# EAGLE design Shield (EAGLE 6.5.0)
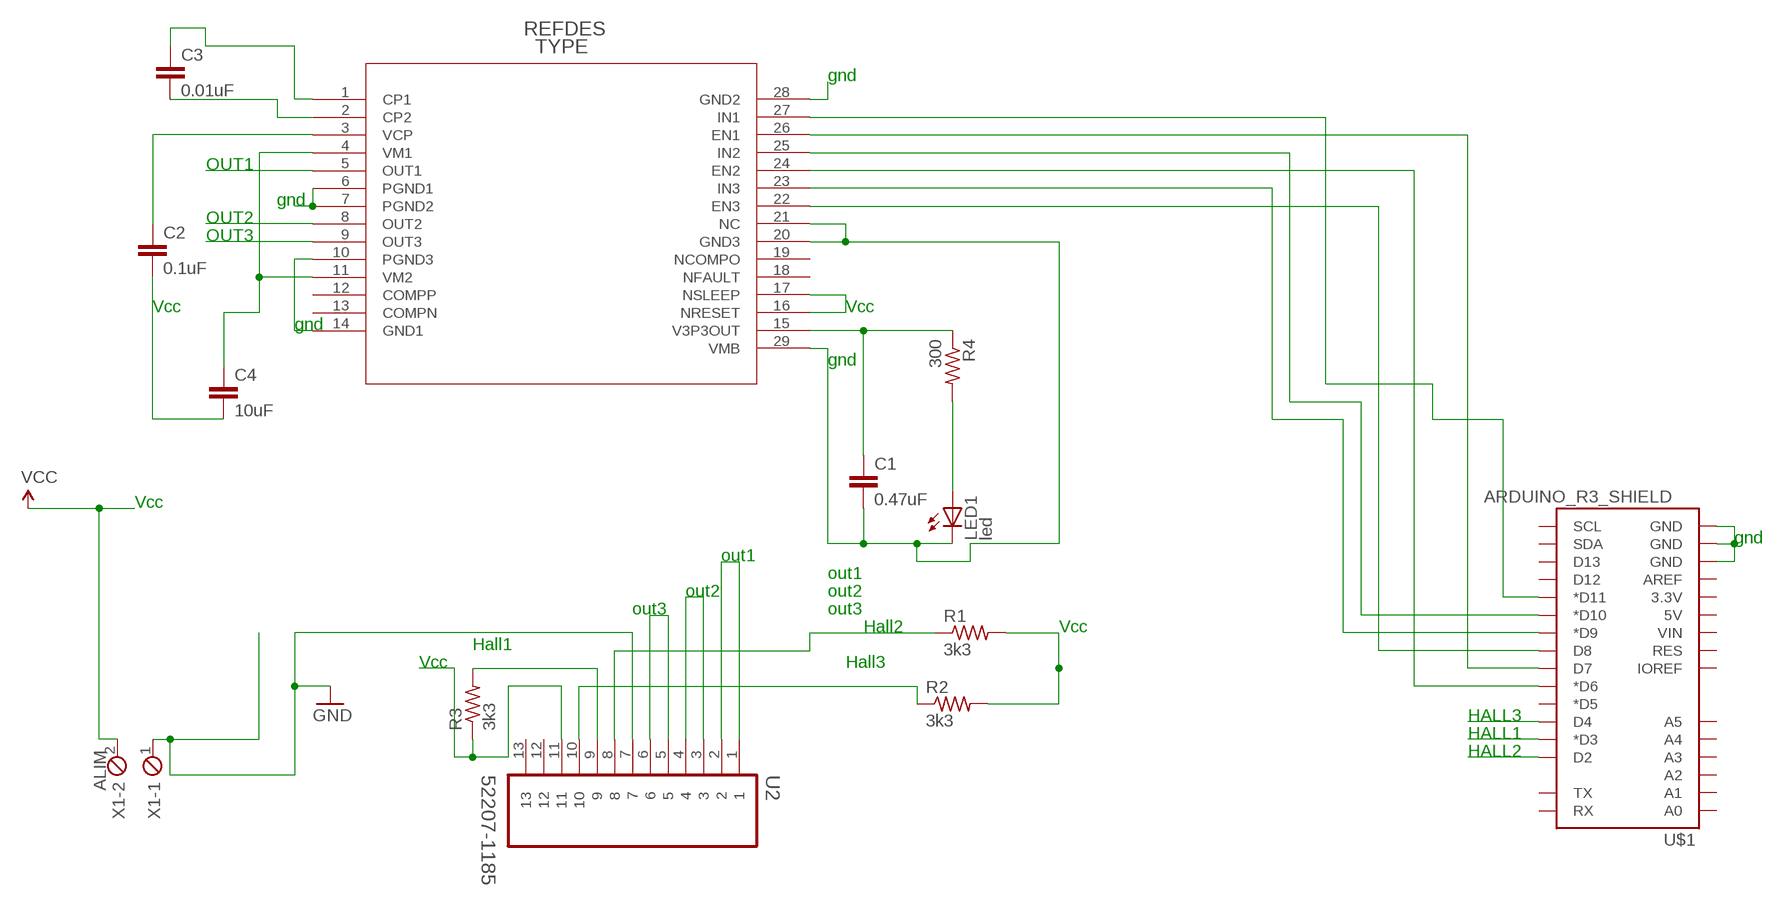
[diagram p0: schematic, sheet 1]

## Parts
C1  0.47uF  C-EU025-025X050  [C025-025X050]
C2  0.1uF  C-EU102-043X133  [C102-043X133]
C3  0.01uF  C-EU025-025X050  [C025-025X050]
C4  10uF  C-EU025-050X050  [C025-050X050]
LED1  led  LED3MM  [LED3MM]
R1  3k3  R-US_0207/10  [0207/10]
R2  3k3  R-US_0207/10  [0207/10]
R3  3k3  R-US_0207/10  [0207/10]
R4  300  R-US_0207/10  [0207/10]
U1  DRV8811_PWP_28  [PWP28_5P18X3P1]
U2  52207-1185  [MOLEX_52207-1185]
U$1  ARDUINO_R3_SHIELD  [UNO_R3_SHIELD]
X1  ALIM  MPT2  [2POL254]

## Nets
GND: C1.2 LED1.K(C) U1.6(PGND1) U1.7(PGND2) U1.10(PGND3) U1.14(GND1) U1.20(GND3) U1.21(NC) U1.28(GND2) U1.29(VMB) U2.7 U$1.GND@0(GND) U$1.GND@1(GND) U$1.GND@2(GND) X1.1
HALL1: R3.2 U2.9 U$1.D3(*D3)
HALL2: R1.1 U2.8 U$1.D2
HALL3: R2.1 U2.10 U$1.D4
N$4: U1.27(IN1) U$1.D11(*D11)
N$5: U1.26(EN1) U$1.D7
N$6: U1.24(EN2) U$1.D6(*D6)
N$7: U1.25(IN2) U$1.D10(*D10)
N$8: U1.23(IN3) U$1.D9(*D9)
N$9: U1.22(EN3) U$1.D8
N$10: LED1.A R4.2
N$11: C1.1 R4.1 U1.15(V3P3OUT)
N$12: C2.1 U1.3(VCP)
N$13: C3.2 U1.2(CP2)
N$14: C3.1 U1.1(CP1)
N$15: C4.1 U1.4(VM1) U1.11(VM2)
OUT1: U1.5(OUT1) U2.1 U2.2
OUT2: U1.8(OUT2) U2.3 U2.4
OUT3: U1.9(OUT3) U2.5 U2.6
VCC: C2.2 C4.2 R1.2 R2.2 R3.1 U1.16(NRESET) U1.17(NSLEEP) U2.11 X1.2
Unconnected: U1.12(COMPP) U1.13(COMPN) U1.18(NFAULT) U1.19(NCOMPO) U2.12 U2.13 U$1.3.3V U$1.5V U$1.A0 U$1.A1 U$1.A2 U$1.A3 U$1.A4 U$1.A5 U$1.AREF U$1.D5(*D5) U$1.D12 U$1.D13 U$1.IOREF U$1.RES U$1.RX U$1.SCL U$1.SDA U$1.TX U$1.VIN

## Notes on the sheet
- gnd
- OUT1
- gnd
- OUT2
- OUT3
- Vcc | Vcc
- gnd
- gnd
- Vcc
- gnd
- out1
- out1
- out2 | out2
- out3 | out3
- Hall2 | Vcc
- Hall1
- Vcc | Hall3
- HALL3
- HALL1
- HALL2

## Library data of the parts
C1-C4 = rcl:C-EU: CAPACITOR, European symbol
LED1 = adafruit:LED: LED OSRAM: - CHIPLED LG R971, LG N971, LY N971, LG Q971, LY Q971, LO R971, LY R971 LH N974, LH R974 LS Q976, LO Q976, LY Q976 LO Q996 - Hyper CHIPLED LW Q18S LB Q993, LB Q99A, LB R99A - SideLED LS A670, LO A670, LY A670, LG A670, LP A670 LB A673, LV A673, LT A673, LW A673 LH A674 LY A675 LS A676, LA A676, LO A676, LY A676, LW A676 LS A679, LY A679, LG A679 - Hyper Micro SIDELED® LS Y876, LA Y876, LO Y876, LY Y876 LT Y87S - SmartLED LW L88C, LW L88S LB L89C, LB L89S, LG L890 LS L89K, LO L89K, LY L89K LS L896, LA L896, LO L896, LY L896 - TOPLED LS T670, LO T670, LY T670, LG T670, LP T670 LSG T670, LSP T670, LSY T670, LOP T670, LYG T670 LG T671, LOG T671, LSG T671 LB T673, LV T673, LT T673, LW T673 LH T674 LS T676, LA T676, LO T676, LY T676, LB T676, LH T676, LSB T676, LW T676 LB T67C, LV T67C, LT T67C, LS T67K, LO T67K, LY T67K, LW E67C LS E67B, LA E67B, LO E67B, LY E67B, LB E67C, LV E67C, LT E67C LW T67C LS T679, LY T679, LG T679 LS T770, LO T770, LY T770, LG T770, LP T770 LB T773, LV T773, LT T773, LW T773 LH T774 LS E675, LA E675, LY E675, LS T675 LS T776, LA T776, LO T776, LY T776, LB T776 LHGB T686 LT T68C, LB T68C - Hyper Mini TOPLED® LB M676 - Mini TOPLED Santana® LG M470 LS M47K, LO M47K, LY M47K Source: http://www.osram.convergy.de/
R1-R4 = adafruit:R-US_: RESISTOR, American symbol
U1 = drv8313_correto:DRV8811_PWP_28
U2 = rc13:52207-1185: SOCKET FPC, SMT, 1MM, 10 WAY; MPN: 52207-1085; OC_FARNELL: 1079938; OC_NEWARK: 58J9503; PACKAGE: SOCKET FPC, SMT, 1MM, 10 WAY; SUPPLIER: Molex
U$1 = SparkFun-Boards:ARDUINO_R3_SHIELD: Shield form compatible with the Arduino Uno R3.
X1 = con-phoenix-254:MPT2: PHOENIX CONNECTOR; OC_FARNELL: unknown; OC_NEWARK: unknown

## Board
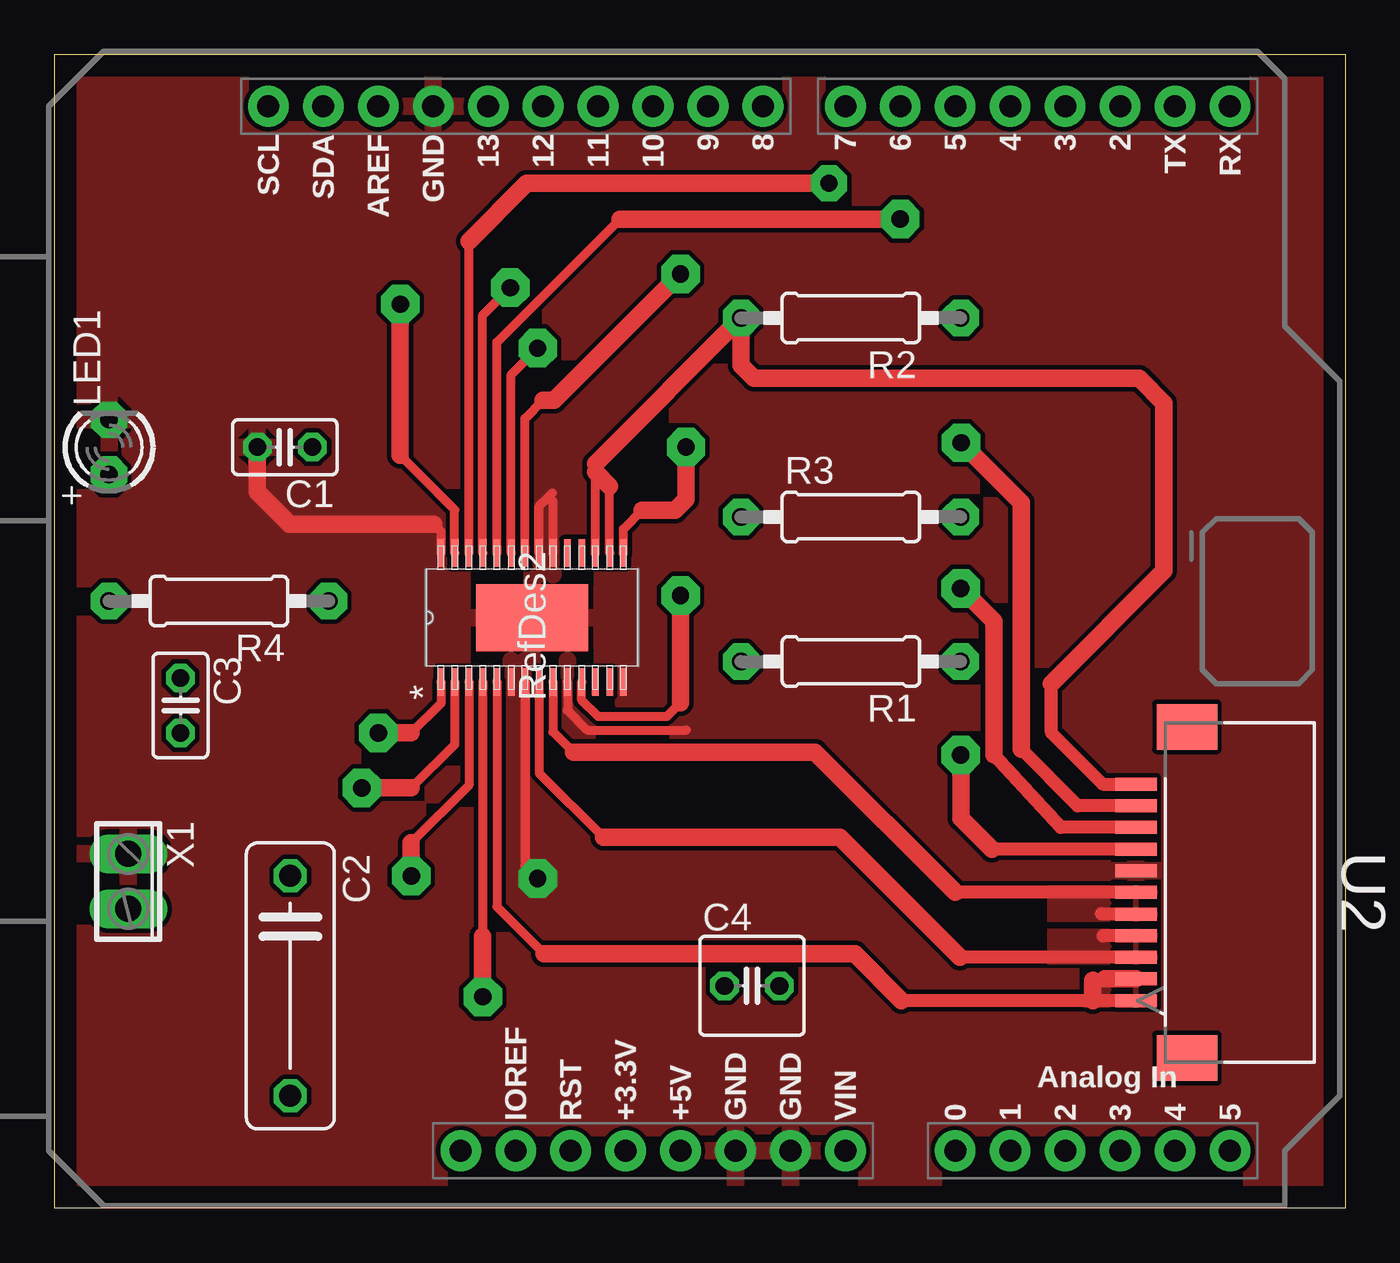
[diagram p1: board, top side]
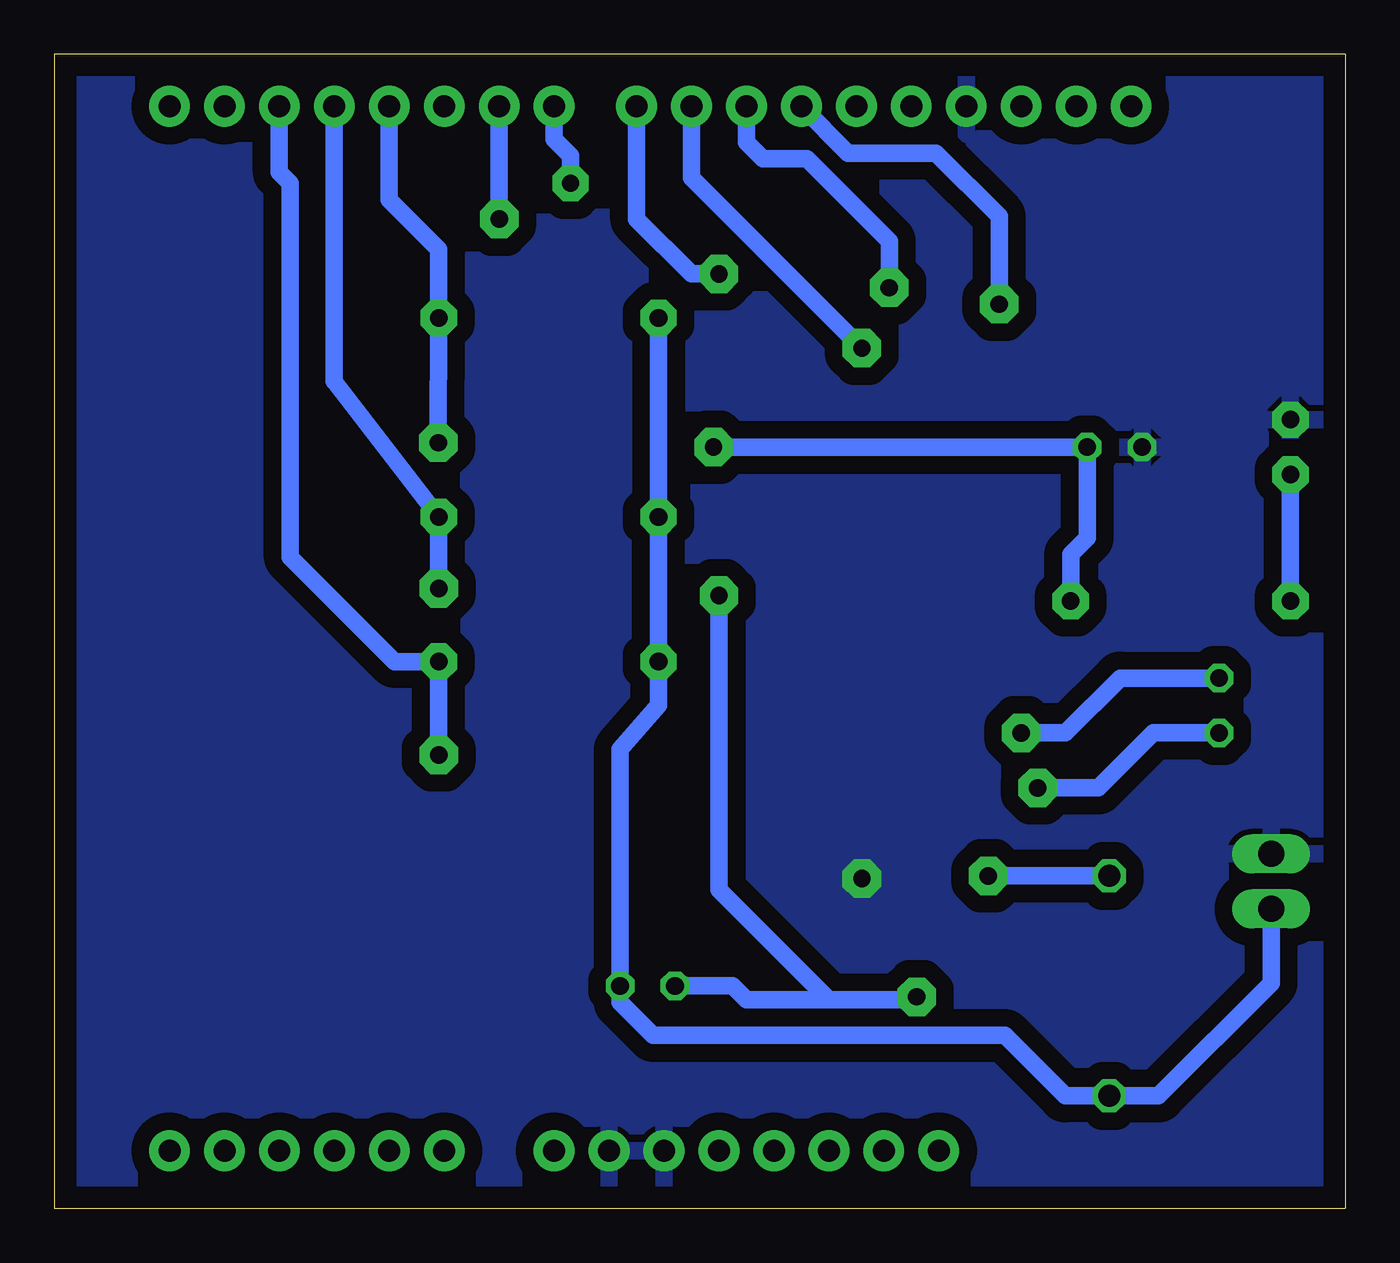
[diagram p2: board, bottom side, seen from below]

Size 59.69 x 53.34 mm. Coordinates in mm from the lower left corner, seen from the top.
Outline: 0,53.34 59.69,53.34 59.69,0 0,0 0,53.34
Copper layers (1*16): Top 0.035mm / dielectric 1.5mm / Bottom 0.035mm
Design rules "default *": minimum track width 1mil, minimum drill 1mil, track to track 8mil, track to pad 8mil, pad to pad 8mil, via to via 8mil, smd to smd 8mil, copper to edge 40mil, drill to drill 8mil, minimum pad ring 10mil, minimum via ring 8mil, stop-mask expansion 4mil, vias tented up to drill 0mil, thermal gap 10mil

### Footprints (pad centres in the part's own frame; a part is rotated, then mirrored left to right if it is on the bottom)
C025-025X050 = drill 0.813 octagon: 1 -1.27,0; 2 1.27,0
C102-043X133 = drill 1.016 octagon: 1 -5.08,0; 2 5.08,0
C025-050X050 = drill 0.813 octagon: 1 -1.27,0; 2 1.27,0
LED3MM = drill 0.813 pad 1.676 octagon: A -1.27,0; K 1.27,0
0207/10 = drill 0.813 pad 1.676 octagon: 1 -5.08,0; 2 5.08,0
PWP28_5P18X3P1 = smd 1.27 x 0.305: 1 -2.972,4.216; 2 -2.972,3.581; 3 -2.972,2.921; 4 -2.972,2.286; 5 -2.972,1.626; 6 -2.972,0.965; 7 -2.972,0.33; 8 -2.972,-0.33; 9 -2.972,-0.965; 10 -2.972,-1.626; 11 -2.972,-2.286; 12 -2.972,-2.921; 13 -2.972,-3.581; 14 -2.972,-4.216; 15 2.972,-4.216; 16 2.972,-3.581; 17 2.972,-2.921; 18 2.972,-2.286; 19 2.972,-1.626; 20 2.972,-0.965; 21 2.972,-0.33; 22 2.972,0.33; 23 2.972,0.965; 24 2.972,1.626; 25 2.972,2.286; 26 2.972,2.921; 27 2.972,3.581; 28 2.972,4.216 | smd 3.099 x 5.182: 29 0,0
MOLEX_52207-1185 = smd 0.6 x 1.9: 1 5,4.8; 2 4,4.8; 3 3,4.8; 4 2,4.8; 5 1,4.8; 6 0,4.8; 7 -1,4.8; 8 -2,4.8; 9 -3,4.8; 10 -4,4.8; 11 -5,4.8 | smd 2.1 x 2.8: 12 -7.65,7.15 | smd 2.108 x 2.794: 13 7.65,7.15
UNO_R3_SHIELD = drill 1.016 pad 1.88: 3.3V 50.8,26.67; 5V 50.8,29.21; A0 50.8,41.91; A1 50.8,44.45; A2 50.8,46.99; A3 50.8,49.53; A4 50.8,52.07; A5 50.8,54.61; AREF 2.54,15.24; D2 2.54,49.53; D3 2.54,46.99; D4 2.54,44.45; D5 2.54,41.91; D6 2.54,39.37; D7 2.54,36.83; D8 2.54,33.02; D9 2.54,30.48; D10 2.54,27.94; D11 2.54,25.4; D12 2.54,22.86; D13 2.54,20.32; GND@0 50.8,31.75; GND@1 50.8,34.29; GND@2 2.54,17.78; IOREF 50.8,21.59; NC 50.8,19.05; RES 50.8,24.13; RX 2.54,54.61; SCL 2.54,10.16; SDA 2.54,12.7; TX 2.54,52.07; VIN 50.8,36.83
2POL254 = drill 1.2 long: 1 -1.27,0; 2 1.27,0

### Placement (x,y rotation side)
C1  10.67,35.18 180 top
C2  10.92,10.29 270 top
C3  5.84,23.24 270 top
C4  32.26,10.29 0 top
LED1  2.54,35.18 90 top
R1  36.83,25.27 180 top
R2  36.83,41.15 180 top
R3  36.83,31.95 0 top
R4  7.62,28.07 180 top
U1  22.1,27.3 90 top
U2  45.21,14.61 270 top
U$1  -0.25,53.47 270 top
X1  3.43,15.11 270 top

### Tracks (layer width: path | path; a pad name or v marks a point on that pad's centre or on a via)
GND  (via drill 0.8 pad 1.78)
  Top 0.406: U1.21 22.43,32.46 22.86,32.89 | 22.86,32.89 23.04,33.07 | U1.20 23.06,32.69 22.86,32.89 | U1.28 17.88,31.29 17.55,31.62 | U1.10 23.72,23.01 24.64,22.1 29.21,22.1 | U1.7 21.77,15.82 v22.35,15.24
  Top 0.813: 17.55,31.62 10.9,31.62 9.4,33.12 C1.2
  pour Bottom (isolate 0.813): 0,0 0,53.34 59.69,53.34 59.69,0
  pour Top (isolate 0.178): -0.25,53.34 60.71,53.34 60.71,0 -0.25,0
HALL1  (via drill 0.8 pad 1.78)
  Top 0.61: U2.9 46.53,17.61 43.43,20.95
  Top 0.813: 43.43,20.95 43.43,27.13 v41.91,28.65
  Bottom 0.813: v41.91,28.65 R3.2 46.74,38.23 U$1.D3
HALL2  (via drill 0.8 pad 1.78)
  Top 0.61: U2.8 43.34,16.61
  Top 0.813: 43.34,16.61 41.91,18.03 v41.91,20.95
  Bottom 0.813: v41.91,20.95 R1.1 43.94,25.27 48.77,30.1 48.77,47.37 49.28,47.88 U$1.D2
HALL3  (via drill 0.8 pad 1.78)
  Top 0.61: U2.10 47.31,18.61 44.7,21.21
  Top 0.813: 44.7,21.21 44.7,32.61 v41.94,35.38
  Bottom 0.813: v41.94,35.38 R2.1 41.91,44.32 44.2,46.61 U$1.D4
N$4  (via drill 0.8 pad 1.78)
  Top 0.406: U1.27 18.52,32.28 16,34.8
  Top 0.813: 16,34.8 v16,41.78
  Bottom 0.813: v16,41.78 16,45.85 18.92,48.77 22.99,48.77 U$1.D11
N$5  (via drill 0.8 pad 1.68)
  Top 0.406: U1.26 19.18,44.7
  Top 0.813: 19.18,44.7 21.84,47.37 v35.81,47.37
  Bottom 0.813: v35.81,47.37 35.81,48.64 36.58,49.4 U$1.D7
N$6  (via drill 0.8 pad 1.78)
  Top 0.406: U1.24 20.47,40.03 26.16,45.72
  Top 0.813: 26.16,45.72 v39.12,45.72
  Bottom 0.813: v39.12,45.72 U$1.D6
N$7  (via drill 0.8 pad 1.78)
  Top 0.406: U1.25 19.81,41.27 v21.08,42.55
  Bottom 0.813: v21.08,42.55 21.08,44.7 24.89,48.51 26.92,48.51 27.69,49.28 U$1.D10
N$8  (via drill 0.8 pad 1.78)
  Top 0.406: U1.23 21.13,38.53 v22.35,39.75
  Bottom 0.813: v22.35,39.75 30.23,47.62 U$1.D9
N$9  (via drill 0.8 pad 1.78)
  Top 0.406: U1.22 21.77,36.5 22.61,37.34
  Top 0.813: 22.61,37.34 23.11,37.34 v28.96,43.18
  Bottom 0.813: v28.96,43.18 30.23,43.18 32.77,45.72 U$1.D8
N$10
  Bottom 0.813: R4.2 LED1.A
N$11  (via drill 0.8 pad 1.78)
  Top 0.406: U1.15 26.31,31.39 27.18,32.26
  Top 0.813: 27.18,32.26 28.7,32.26 29.21,32.77 v29.21,35.18
  Bottom 0.813: v29.21,35.18 C1.1 11.94,30.99 12.7,30.23 R4.1
N$12  (via drill 0.8 pad 1.78)
  Top 0.406: U1.3 19.18,19.56 16.51,16.89
  Top 0.813: v16.51,15.37 16.51,16.89
  Bottom 0.813: v16.51,15.37 C2.1
N$13  (via drill 0.8 pad 1.78)
  Top 0.406: U1.2 18.52,21.44 16.51,19.43
  Top 0.813: 16.51,19.43 v14.22,19.43
  Bottom 0.813: v14.22,19.43 11.43,19.43 8.89,21.97 C3.2
N$14  (via drill 0.8 pad 1.78)
  Top 0.406: U1.1 17.88,23.34 16.51,21.97
  Top 0.813: 16.51,21.97 v14.99,21.97
  Bottom 0.813: v14.99,21.97 12.95,21.97 10.41,24.51 C3.1
N$15  (via drill 0.8 pad 1.78)
  Top 0.406: 19.81,12.57 U1.4 19.81,18.92 | U1.11 24.38,23.5 25.15,22.73 28.32,22.73 28.96,23.37
  Top 0.813: 19.81,12.57 v19.81,9.78 | 28.96,23.37 v28.96,28.32
  Bottom 0.813: v28.96,28.32 28.96,14.73 23.88,9.65 | 23.88,9.65 19.94,9.65 v19.81,9.78 | C4.1 28.32,10.29 27.69,9.65 23.88,9.65
OUT1
  Top 0.406: 49.95,10.54 U2.2 | U1.5 20.47,13.95 22.66,11.76
  Top 0.61: U2.1 48.01,9.61 39.16,9.61
  Top 0.813: 22.66,11.76 37.01,11.76 39.16,9.61 | U2.2 48.57,10.61 | 48.01,10.54 48.01,9.61
  pour Top (isolate 0.813): 50.98,11.02 50.98,9.27 47.6,9.27 47.6,11 47.6,11.02
OUT2
  Top 0.406: 25.4,17.14 22.43,20.12 U1.8 | 49.92,12.7 U2.4
  Top 0.61: U2.3 41.86,11.61 | U2.4 48.49,12.61 48.49,12.6
  Top 0.813: 25.4,17.14 36.32,17.14 41.86,11.61
  pour Top: 45.92,12.93 51,12.93 51,11.25 45.92,11.25
OUT3
  Top 0.406: U1.9 23.06,22.02 24,21.08
  Top 0.61: U2.6 41.66,14.61 | U2.5 48.41,13.61 48.41,13.64
  Top 0.813: 41.66,14.61 35.18,21.08 24,21.08
  pour Top: 51,13.26 45.92,13.26 45.92,14.94 51,14.94
VCC
  Top 0.406: U1.17 25.02,34.04 25.02,34.42 | U1.16 25.68,33.38
  Top 0.61: U2.11 48.47,19.61 46.1,21.97 46.1,24.26
  Top 0.813: 46.1,24.26 51.31,29.46 51.31,37.21 50.16,38.35 32.36,38.35 31.75,38.96 R2.2 25.02,34.42 | 25.68,33.38 25.02,34.04
  Bottom 0.813: R2.2 R3.1 R1.2 31.75,23.24 33.53,21.21 C4.2 33.53,9.53 32,8 15.75,8 12.95,5.21 C2.2 8.64,5.21 3.43,10.41 X1.2